# Altium project PCB_Project.PrjPcb
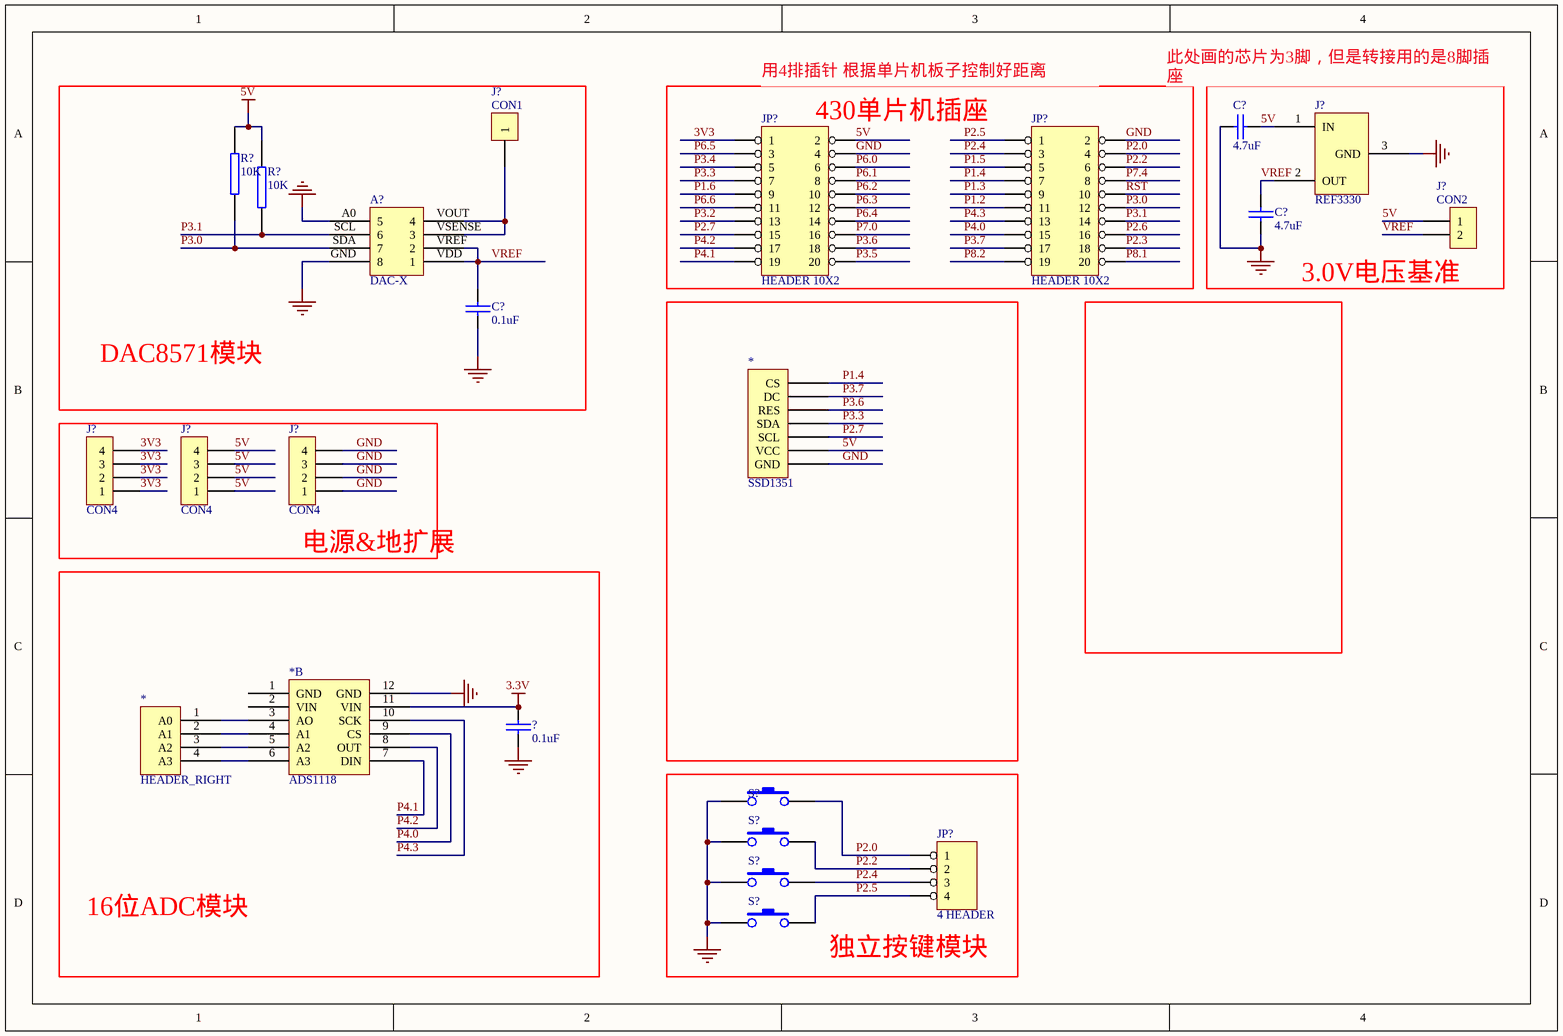
[diagram p0: AT long bus (13.3 x 4.2 inches).schdoc]
1 sheet, 23 parts. Net scope: global (net labels, ports and power ports of the same name join across sheets).
Board file: AT long bus (13.3 x 4.2 inches).PCBDOC

## Sheet AT long bus (13.3 x 4.2 inches).schdoc: AT long bus (13.3 x 4.2 inches)
size A4; Organization: Organization; Address1: Address1; Address2: Address2; Address3: Address3; Address4: Address4; DocumentNumber: 1; Revision: 0; SheetNumber: 2; SheetTotal: 2

### Parts
(Parts that share a designator on the sheet are numbered #1, #2 ... from top to bottom, then left to right.)
*#1  SSD1351
*#2  HEADER_RIGHT
*#3  ADS1118  (part B of 2)
?  0.1uF
A?  DAC-X
C?#1  4.7uF
C?#2  4.7uF
C?#3  0.1uF
J?#1  REF3330
J?#2  CON1
J?#3  CON2
J?#4  CON4
J?#5  CON4
J?#6  CON4
JP?#1  HEADER 10X2
JP?#2  HEADER 10X2
JP?#3  4 HEADER
R?#1  10K
R?#2  10K
S?#1  (no value)
S?#2  (no value)
S?#3  (no value)
S?#4  (no value)

### Nets
3.3V: *#3.11(VIN) ?.1
5V: *#1.2(VCC) C?#1.2 J?#1.1(IN) J?#3.1 J?#5.1 J?#5.2 J?#5.3 J?#5.4 JP?#1.2 R?#1.1 R?#2.2
GND: *#1.1(GND) C?#1.1 C?#2.2 J?#1.3(GND) J?#6.1 J?#6.2 J?#6.3 J?#6.4 JP?#1.4 JP?#2.2 S?#1.1 S?#2.1 S?#3.1 S?#4.1
VCC: *#3.12(GND) ?.2 A?.A0(5) A?.GND(8) C?#3.2
3V3: J?#4.1 J?#4.2 J?#4.3 J?#4.4 JP?#1.1
P1.2: JP?#2.11
P1.3: JP?#2.9
P1.4: *#1.7(CS) JP?#2.7
P1.5: JP?#2.5
P1.6: JP?#1.9
P2.0: JP?#2.4 JP?#3.1 S?#1.2
P2.2: JP?#2.6 JP?#3.2 S?#2.2
P2.3: JP?#2.18
P2.4: JP?#2.3 JP?#3.3 S?#3.2
P2.5: JP?#2.1 JP?#3.4 S?#4.2
P2.6: JP?#2.16
P2.7: *#1.3(SCL) JP?#1.15
P3.0: A?.SDA(7) JP?#2.12 R?#2.1
P3.1: A?.SCL(6) JP?#2.14 R?#1.2
P3.2: JP?#1.13
P3.3: *#1.4(SDA) JP?#1.7
P3.4: JP?#1.5
P3.5: JP?#1.20
P3.6: *#1.5(RES) JP?#1.18
P3.7: *#1.6(DC) JP?#2.17
P4.0: *#3.9(CS) JP?#2.15
P4.1: *#3.7(DIN) JP?#1.19
P4.2: *#3.8(OUT) JP?#1.17
P4.3: *#3.10(SCK) JP?#2.13
P6.0: JP?#1.6
P6.1: JP?#1.8
P6.2: JP?#1.10
P6.3: JP?#1.12
P6.4: JP?#1.14
P6.5: JP?#1.3
P6.6: JP?#1.11
P7.0: JP?#1.16
P7.4: JP?#2.8
P8.1: JP?#2.20
P8.2: JP?#2.19
RST: JP?#2.10
VREF: A?.VDD(1) A?.VREF(2) C?#2.1 C?#3.1 J?#1.2(OUT) J?#3.2
Net*#2_1: *#2.1(A0) *#3.3(AO)
Net*#2_2: *#2.2(A1) *#3.4(A1)
Net*#2_3: *#2.3(A2) *#3.5(A2)
Net*#2_4: *#2.4(A3) *#3.6(A3)
NetA?_VOUT: A?.VOUT(4) A?.VSENSE(3) J?#2.1

Not connected (* = marked no-connect by the designer): *#3 1(GND) 2(VIN)

### Notes on the sheet
- 用4排插针 根据单片机板子控制好距离
- 此处画的芯片为3脚，但是转接用的是8脚插座
- (near JP?#1) 430单片机插座
- 3.0V电压基准
- DAC8571模块
- (near J?#6) 电源&地扩展
- 16位ADC模块
- 独立按键模块

### Library data of the parts
? C?#1-C?#3 = CAP: Capacitor
J?#2 = CON1: Connector
J?#3 = CON2: Connector
J?#4-J?#6 = CON4: Connector
JP?#3 = 4 HEADER: 4 Pin Header
R?#1 R?#2 = RES2
S?#1-S?#4 = SW-PB